# Altium schematic sheet 01_Cover_Page.SchDoc
size A3; SheetNumber: 1; SheetTotal: 8
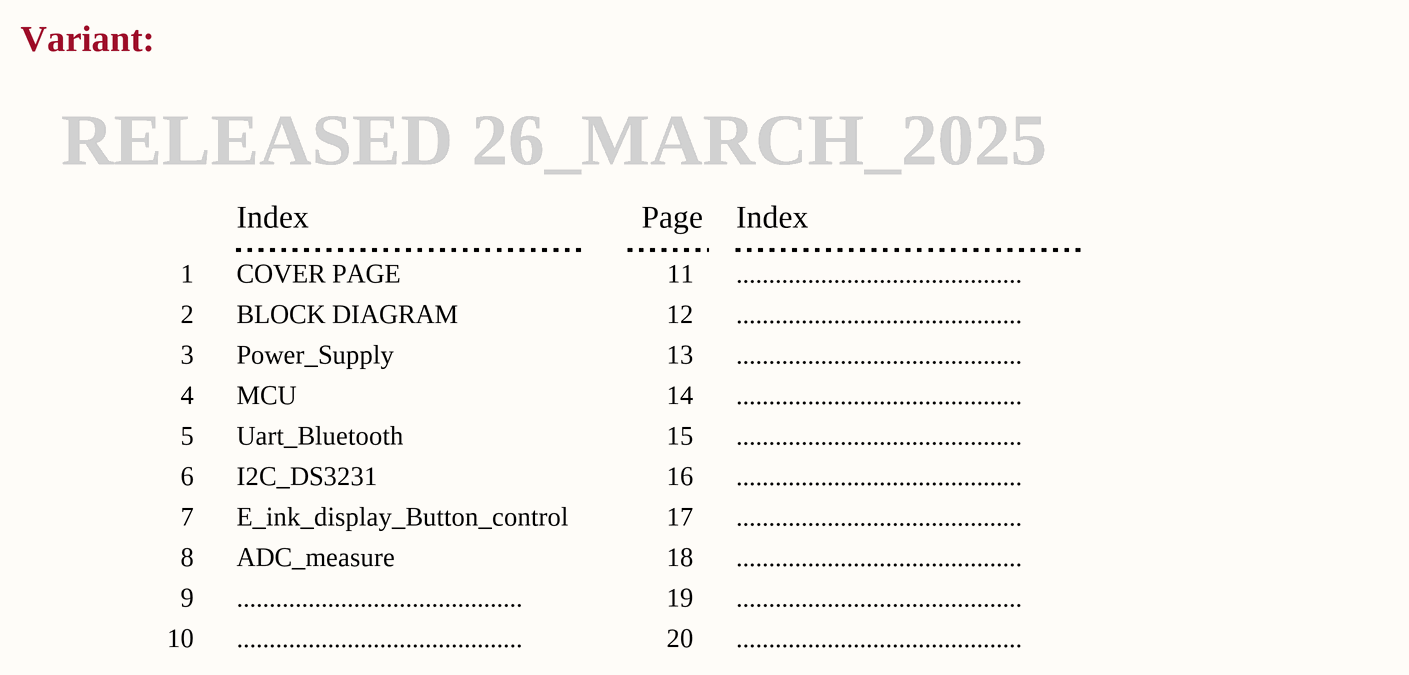
[diagram p0: 01_Cover_Page.SchDoc]

## Notes on the sheet
- Variant:
- RELEASED 26_MARCH_2025
- Index
- Page
- 1
- COVER PAGE
- 11
- ............................................
- 2
- 3
- BLOCK DIAGRAM
- Power_Supply
- 12
- 13
- 4
- 5
- MCU
- Uart_Bluetooth
- 14
- 15
- 6
- I2C_DS3231
- 16
- 7
- 8
- E_ink_display_Button_control
- ADC_measure
- 17
- 18
- 9
- 10
- 19
- 20